# EAGLE schematic servo-pcb (EAGLE 9.6.2)
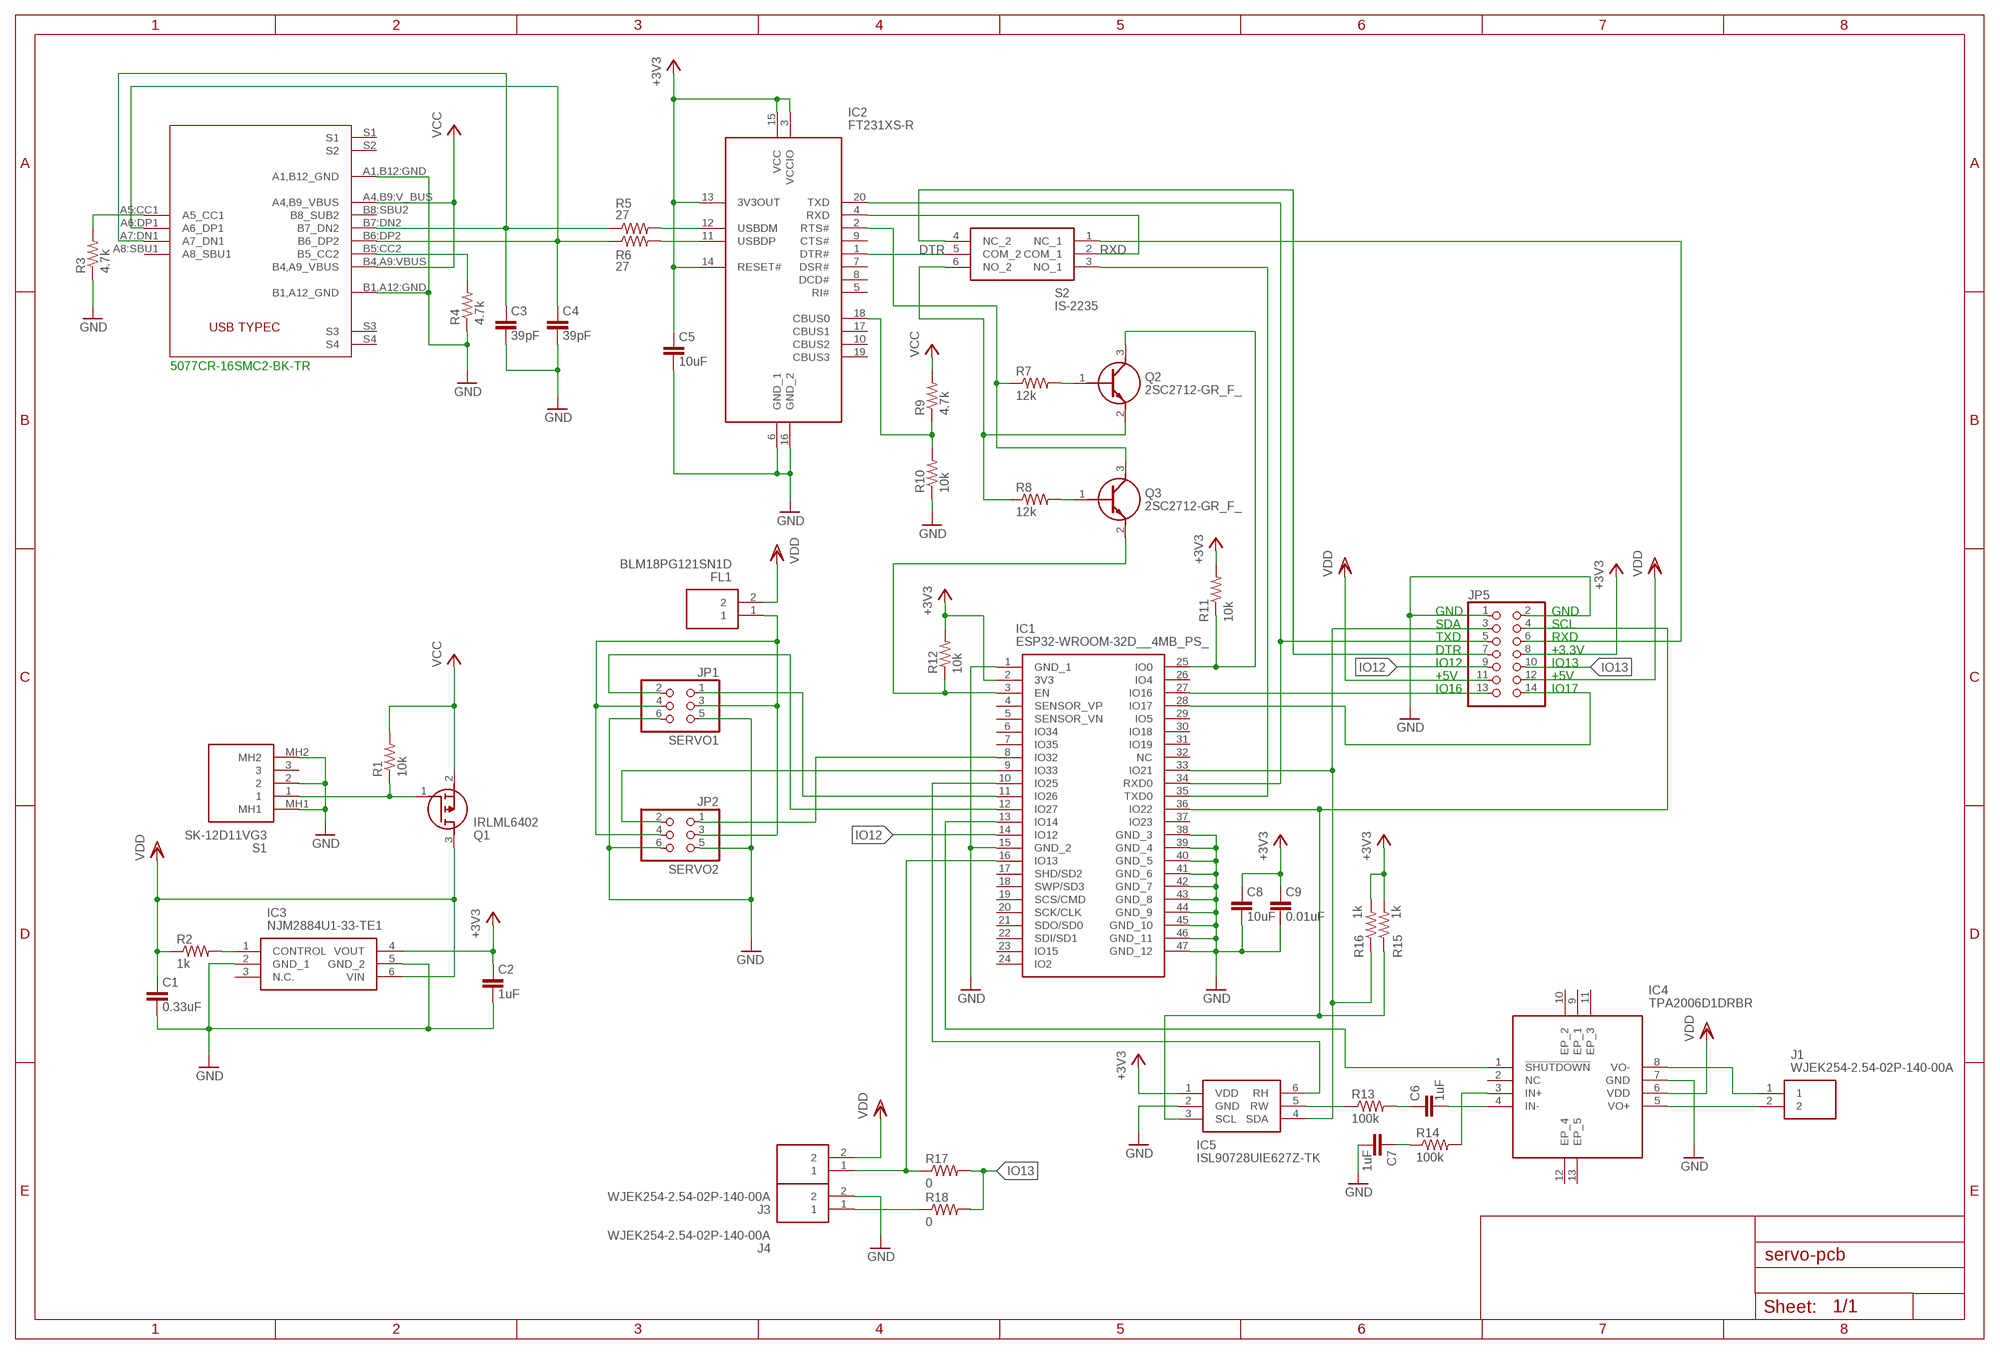
[diagram p0: schematic, sheet 1]

## Parts
C1  0.33uF  C-EUC0603  [C0603]
C2  1uF  C-EUC0603  [C0603]
C3  39pF  C-EUC0603  [C0603]
C4  39pF  C-EUC0603  [C0603]
C5  10uF  C-EUC0805  [C0805]
C6  1uF  C-EUC0603  [C0603]
C7  1uF  C-EUC0603  [C0603]
C8  10uF  C-EUC0805  [C0805]
C9  0.01uF  C-EUC0603  [C0603]
FL1  BLM18PG121SN1D  [BLM18AG102BH1D]
IC1  ESP32-WROOM-32D__4MB_PS_  [ESP32WROOM32D4MBPS]
IC2  FT231XS-R  [SOP64P599X175-20N]
IC3  NJM2884U1-33-TE1  [SOT-89-5-1]
IC4  TPA2006D1DRBR  [TPA2006D1DRBR]
IC5  ISL90728UIE627Z-TK  [SOT65P210X110-6N]
J1  WJEK254-2.54-02P-140-00A  [WJEK25425402P14000A]
J3  WJEK254-2.54-02P-140-00A  [WJEK25425402P14000A]
J4  WJEK254-2.54-02P-140-00A  [WJEK25425402P14000A]
JP1  SERVO1  PINHD-2X3/90  [2X03/90]
JP2  SERVO2  PINHD-2X3/90  [2X03/90]
JP5  PINHD-2X7  [2X07]
Q1  IRLML6402  [SOT95P237X112-3N]
Q2  2SC2712-GR_F_  [SSM3K7002CFULF]
Q3  2SC2712-GR_F_  [SSM3K7002CFULF]
R1  10k  R-US_R0603  [R0603]
R2  1k  R-US_R0603  [R0603]
R3  4.7k  R-US_R0603  [R0603]
R4  4.7k  R-US_R0603  [R0603]
R5  27  R-US_R0603  [R0603]
R6  27  R-US_R0603  [R0603]
R7  12k  R-US_R0603  [R0603]
R8  12k  R-US_R0603  [R0603]
R9  4.7k  R-US_R0603  [R0603]
R10  10k  R-US_R0603  [R0603]
R11  10k  R-US_R0603  [R0603]
R12  10k  R-US_R0603  [R0603]
R13  100k  R-US_R0603  [R0603]
R14  100k  R-US_R0603  [R0603]
R15  1k  R-US_R0603  [R0603]
R16  1k  R-US_R0603  [R0603]
R17  0  R-US_R0603  [R0603]
R18  0  R-US_R0603  [R0603]
S1  SK-12D11VG3  [SK12D11VG3]
S2  IS-2235  [IS2235]
U$1  5077CR-16-SMC2-BK-TR  [5077CR-16SMC2-BK-TR]

## Nets
+3V3 [POWER]: C2.1 C5.1 C8.1 C9.1 IC1.2(3V3) IC2.3(VCCIO) IC2.13(3V3OUT) IC2.14(RESET#) IC2.15(VCC) IC3.4(VOUT) IC5.1(VDD) JP5.8 R11.2 R12.2 R15.2 R16.2
DTR: IC2.1(DTR#) S2.5(COM_2)
GND: C1.2 C2.2 C3.2 C4.2 C5.2 C7.2 C8.2 C9.2 IC1.1(GND_1) IC1.15(GND_2) IC1.38(GND_3) IC1.39(GND_4) IC1.40(GND_5) IC1.41(GND_6) IC1.42(GND_7) IC1.43(GND_8) IC1.44(GND_9) IC1.45(GND_10) IC1.46(GND_11) IC1.47(GND_12) IC2.6(GND_1) IC2.16(GND_2) IC3.2(GND_1) IC3.5(GND_2) IC4.7(GND) IC5.2(GND) J4.2 JP1.5 JP1.6 JP2.5 JP2.6 JP5.1 JP5.2 R3.1 R4.1 R10.1 S1.2 S1.MH1 S1.MH2 U$1.A1,B12:GND(A1,B12_GND) U$1.B1,A12:GND(B1,A12_GND)
IO12: IC1.14(IO12) JP5.9
IO13: JP5.10 R17.2 R18.2
N$1: C4.1 R6.1 U$1.A6:DP1(A6_DP1) U$1.B6:DP2(B6_DP2)
N$2: Q1.1(G) R1.1 S1.1
N$3: IC3.1(CONTROL) R2.2
N$4: IC1.28(IO17) JP5.14
N$5: C3.1 R5.1 U$1.A7:DN1(A7_DN1) U$1.B7:DN2(B7_DN2)
N$6: IC1.34(RXD0) IC2.20(TXD) JP5.5
N$7: IC2.12(USBDM) R5.2
N$8: IC2.11(USBDP) R6.2
N$9: IC2.2(RTS#) Q3.3(C) R7.1
N$10: Q2.1(B) R7.2
N$11: Q2.2(E) R8.1 S2.6(NO_2)
N$12: Q3.1(B) R8.2
N$13: IC2.18(CBUS0) R9.1 R10.2
N$14: IC1.3(EN) Q3.2(E) R12.1
N$15: IC1.25(IO0) Q2.3(C) R11.1
N$16: IC1.35(TXD0) S2.3(NO_1)
N$17: JP5.7 S2.4(NC_2)
N$18: IC5.5(RW) R13.1
N$19: C6.1 R13.2
N$20: C6.2 IC4.4(IN-)
N$21: IC4.3(IN+) R14.2
N$22: C7.1 R14.1
N$23: IC1.36(IO22) IC5.3(SCL) JP5.4 R15.1
N$24: IC1.33(IO21) IC5.4(SDA) JP5.3 R16.1
N$25: IC1.13(IO14) IC4.1(!SHUTDOWN)
N$26: IC4.8(VO-) J1.1
N$27: IC4.5(VO+) J1.2
N$28: IC1.10(IO25) IC5.6(RH)
N$29: IC1.16(IO13) J3.1 R17.1
N$30: IC1.11(IO26) JP1.1
N$31: IC1.12(IO27) JP1.2
N$32: IC1.8(IO32) JP2.1
N$33: IC1.9(IO33) JP2.2
N$34: IC1.27(IO16) JP5.13
N$35: R4.2 U$1.B5:CC2(B5_CC2)
N$36: J4.1 R18.1
N$38 [POWER]: FL1.1 JP1.3 JP1.4 JP2.3 JP2.4
N$41: JP5.6 S2.1(NC_1)
N$42: R3.2 U$1.A5:CC1(A5_CC1)
RXD: IC2.4(RXD) S2.2(COM_1)
VCC [POWER]: Q1.2(S) R1.2 R9.2 U$1.A4,B9:V_BUS(A4,B9_VBUS) U$1.B4,A9:VBUS(B4,A9_VBUS)
VDD [POWER]: C1.1 FL1.2 IC3.6(VIN) IC4.6(VDD) J3.2 JP5.11 JP5.12 Q1.3(D) R2.1
Unconnected: IC1.4(SENSOR_VP) IC1.5(SENSOR_VN) IC1.6(IO34) IC1.7(IO35) IC1.17(SHD/SD2) IC1.18(SWP/SD3) IC1.19(SCS/CMD) IC1.20(SCK/CLK) IC1.21(SDO/SD0) IC1.22(SDI/SD1) IC1.23(IO15) IC1.24(IO2) IC1.26(IO4) IC1.29(IO5) IC1.30(IO18) IC1.31(IO19) IC1.32(NC) IC1.37(IO23) IC2.5(RI#) IC2.7(DSR#) IC2.8(DCD#) IC2.9(CTS#) IC2.10(CBUS2) IC2.17(CBUS1) IC2.19(CBUS3) IC3.3(N.C.) IC4.2(NC) IC4.9(EP_1) IC4.10(EP_2) IC4.11(EP_3) IC4.12(EP_4) IC4.13(EP_5) S1.3 U$1.A8:SBU1(A8_SBU1) U$1.B8:SBU2(B8_SUB2) U$1.S1 U$1.S2 U$1.S3 U$1.S4

## Notes on the sheet
- 5077CR-16SMC2-BK-TR
- GND | GND
- SDA | SCL
- TXD | RXD
- DTR | +3.3V
- IO12 | IO13
- +5V | +5V
- IO16 | IO17

## Library data of the parts
C1-C9 = rcl:C-EU: CAPACITOR, European symbol; SPICEPREFIX: C
FL1 = SamacSys_Parts:BLM18PG121SN1D: Ferrite bead SMD 0603 120R 2A Murata Ferrite Bead (Chip Ferrite Bead), 1.6 x 0.8 x 0.8mm (0603), 120 impedance at 100 MHz Source: Datasheet <https://www.murata.com/en-us/products/productdetail?partno=BLM18PG121SN1#>; ARROW_PART_NUMBER: BLM18PG121SN1D; ARROW_PRICE-STOCK: https://www.arrow.com/en/products/blm18pg121sn1d/murata-manufacturing?region=nac; DESCRIPTION: Ferrite bead SMD 0603 120R 2A Murata Ferrite Bead (Chip Ferrite Bead), 1.6 x 0.8 x 0.8mm (0603), 120 impedance at 100 MHz; HEIGHT: 0.95mm; MANUFACTURER_NAME: Murata Electronics; MANUFACTURER_PART_NUMBER: BLM18PG121SN1D; MOUSER_PART_NUMBER: 81-BLM18PG121SN1D; MOUSER_PRICE-STOCK: https://www.mouser.co.uk/ProductDetail/Murata-Electronics/BLM18PG121SN1D?qs=tY8e8KZalarVxhnmnUYZ1A%3D%3D
IC1 = SamacSys_Parts:ESP32-WROOM-32D__4MB_PS_: WiFi Modules (802.11) Source: Datasheet <https://www.mouser.com/datasheet/2/891/esp32-wroom-32d_esp32-wroom-32u_datasheet_en-1365844.pdf>; DESCRIPTION: WiFi Modules (802.11); HEIGHT: 3.2mm; MANUFACTURER_NAME: Espressif Systems; MANUFACTURER_PART_NUMBER: ESP32-WROOM-32D (4MB PS); MOUSER_PART_NUMBER: 356-ESPWROOM3200PS3; MOUSER_PRICE-STOCK: https://www.mouser.co.uk/ProductDetail/Espressif-Systems/ESP32-WROOM-32D-4MB-PS?qs=GBLSl2Akirs5uooPY1MBgw%3D%3D
IC2 = SamacSys_Parts:FT231XS-R: FTDI Chip FT231XS-R, Interface RS232, RS422, RS485, SIE, UART 3MBd, 5 V, 20-pin, SSOP Source: Datasheet <https://datasheet.datasheetarchive.com/originals/distributors/Datasheets_SAMA/824938d1687833d6997706543241551a.pdf>; ARROW_PART_NUMBER: FT231XS-R; ARROW_PRICE-STOCK: https://www.arrow.com/en/products/ft231xs-r/ftdi-chip?region=nac; DESCRIPTION: FTDI Chip FT231XS-R, Interface RS232, RS422, RS485, SIE, UART 3MBd, 5 V, 20-pin, SSOP; HEIGHT: 1.753mm; MANUFACTURER_NAME: FTDI Chip; MANUFACTURER_PART_NUMBER: FT231XS-R; MOUSER_PART_NUMBER: 895-FT231XS-R; MOUSER_PRICE-STOCK: https://www.mouser.co.uk/ProductDetail/FTDI/FT231XS-R?qs=Gp1Yz1mis3WduRPsgrTbtg%3D%3D
IC3 = SamacSys_Parts:NJM2884U1-33-TE1: Low Dropout Voltage Regulator New Japan Radio NJM2884U1-33-TE1, LDO Voltage Regulator, 0.65A, 3.3 V +/-1%, 5-Pin SOT-89 Source: Datasheet <https://datasheet.datasheetarchive.com/originals/distributors/Datasheets_SAMA/b94e053d9cfcd12f7d94bbb1d1d41848.pdf>; DESCRIPTION: Low Dropout Voltage Regulator New Japan Radio NJM2884U1-33-TE1, LDO Voltage Regulator, 0.65A, 3.3 V +/-1%, 5-Pin SOT-89; HEIGHT: mm; MANUFACTURER_NAME: New Japan Radio; MANUFACTURER_PART_NUMBER: NJM2884U1-33-TE1; MOUSER_PART_NUMBER: 513-NJM2884U1-33-TE1; MOUSER_PRICE-STOCK: https://www.mouser.co.uk/ProductDetail/NJR/NJM2884U1-33-TE1?qs=3unH%2FDqlvl8RhrRFn1uloA%3D%3D
IC4 = SamacSys_Parts:TPA2006D1DRBR: 1.45-W Mono Class-D Audio Amplifier with 1.8V Compatible Shutdown Voltage (TPA2006) Source: Datasheet <http://www.ti.com/lit/gpn/tpa2006d1>; ARROW_PART_NUMBER: TPA2006D1DRBR; ARROW_PRICE-STOCK: https://www.arrow.com/en/products/tpa2006d1drbr/texas-instruments?region=nac; DESCRIPTION: 1.45-W Mono Class-D Audio Amplifier with 1.8V Compatible Shutdown Voltage (TPA2006); HEIGHT: 1mm; MANUFACTURER_NAME: Texas Instruments; MANUFACTURER_PART_NUMBER: TPA2006D1DRBR; MOUSER_PART_NUMBER: 595-TPA2006D1DRBR; MOUSER_PRICE-STOCK: https://www.mouser.co.uk/ProductDetail/Texas-Instruments/TPA2006D1DRBR?qs=SnxTrzcm0Gh2qVAbmaRmZA%3D%3D
IC5 = SamacSys_Parts:ISL90728UIE627Z-TK: DCPs Single Volatile 128-Tap Digitally Controlled Potentiometer (XDCP) Source: Datasheet <https://www.renesas.com/en-us/www/doc/datasheet/isl90727-28.pdf>; DESCRIPTION: DCPs Single Volatile 128-Tap Digitally Controlled Potentiometer (XDCP); HEIGHT: 1.1mm; MANUFACTURER_NAME: Renesas Electronics; MANUFACTURER_PART_NUMBER: ISL90728UIE627Z-TK; MOUSER_PART_NUMBER: 968-ISL90728UIE627ZT; MOUSER_PRICE-STOCK: https://www.mouser.co.uk/ProductDetail/Renesas-Intersil/ISL90728UIE627Z-TK?qs=dAsayXGOMrvlFcRbd2EYPg%3D%3D
J1 J3 J4 = SamacSys_Parts:WJEK254-2.54-02P-140-00A: Wire to Board Connector Source: Datasheet <https://akizukidenshi.com/download/ds/cixiwanjie/WJEK254-2.54-XXP-1YY-00A.pdf>; DESCRIPTION: Wire to Board Connector; HEIGHT: 8.64mm; MANUFACTURER_NAME: Cixi Wanjie Electronic Co., Ltd; MANUFACTURER_PART_NUMBER: WJEK254-2.54-02P-140-00A
JP1 JP2 = pinhead:PINHD-2X3: PIN HEADER
JP5 = pinhead:PINHD-2X7: PIN HEADER
Q1 = SamacSys_Parts:IRLML6402: P-Channel MOSFET Transistor, 3.7 A, 20 V, 3-Pin SOT-23 International Rectifier IRLML6402 Source: Datasheet <https://datasheetspdf.com/pdf/513015/InternationalRectifier/IRLML6402/1>; DESCRIPTION: P-Channel MOSFET Transistor, 3.7 A, 20 V, 3-Pin SOT-23 International Rectifier IRLML6402; HEIGHT: 1.12mm; MANUFACTURER_NAME: Infineon; MANUFACTURER_PART_NUMBER: IRLML6402; MOUSER_PART_NUMBER: N/A; MOUSER_PRICE-STOCK: https://www.mouser.co.uk/ProductDetail/Infineon-IR/IRLML6402?qs=Gkr2N%2F2q3o277qI%252BRzUP%252Bw%3D%3D
Q2 Q3 = SamacSys_Parts:2SC2712-GR_F_: Vceo50V,Ic0.15A,Vce(sat)0.25V,hfe200to40 Toshiba 2SC2712-GR(F) NPN Bipolar Transistor, 0.15 A, 50 V, 3-Pin SC-59 Source: Datasheet <https://toshiba.semicon-storage.com/ap-en/product/bipolar-transistor/bipolar-transistor/detail.2SC2712.html>; DESCRIPTION: Vceo50V,Ic0.15A,Vce(sat)0.25V,hfe200to40 Toshiba 2SC2712-GR(F) NPN Bipolar Transistor, 0.15 A, 50 V, 3-Pin SC-59; HEIGHT: mm; MANUFACTURER_NAME: Toshiba; MANUFACTURER_PART_NUMBER: 2SC2712-GR(F)
R1-R18 = rcl:R-US_: RESISTOR, American symbol; SPICEPREFIX: R
S1 = SamacSys_Parts:SK-12D11VG3: Slide Switch Source: Datasheet <https://akizukidenshi.com/download/ds/jinbeili/AKIZUKI-SK-12D11VG3.pdf>; DESCRIPTION: Slide Switch; HEIGHT: 3.8mm; MANUFACTURER_NAME: Xiamen; MANUFACTURER_PART_NUMBER: SK-12D11VG3
S2 = SamacSys_Parts:IS-2235: Tiny Slide Switch, 2P2T Source: Datasheet <http://www.switronic.com/gallery/detail/400>; DESCRIPTION: Tiny Slide Switch, 2P2T; HEIGHT: 5mm; MANUFACTURER_NAME: Switronic; MANUFACTURER_PART_NUMBER: IS-2235
U$1 = FaBo-Connetor:5077CR-16-SMC2-BK-TR

## Net classes
1 POWER: width 0.508 mm